# EAGLE design Electrode (EAGLE 4.09)
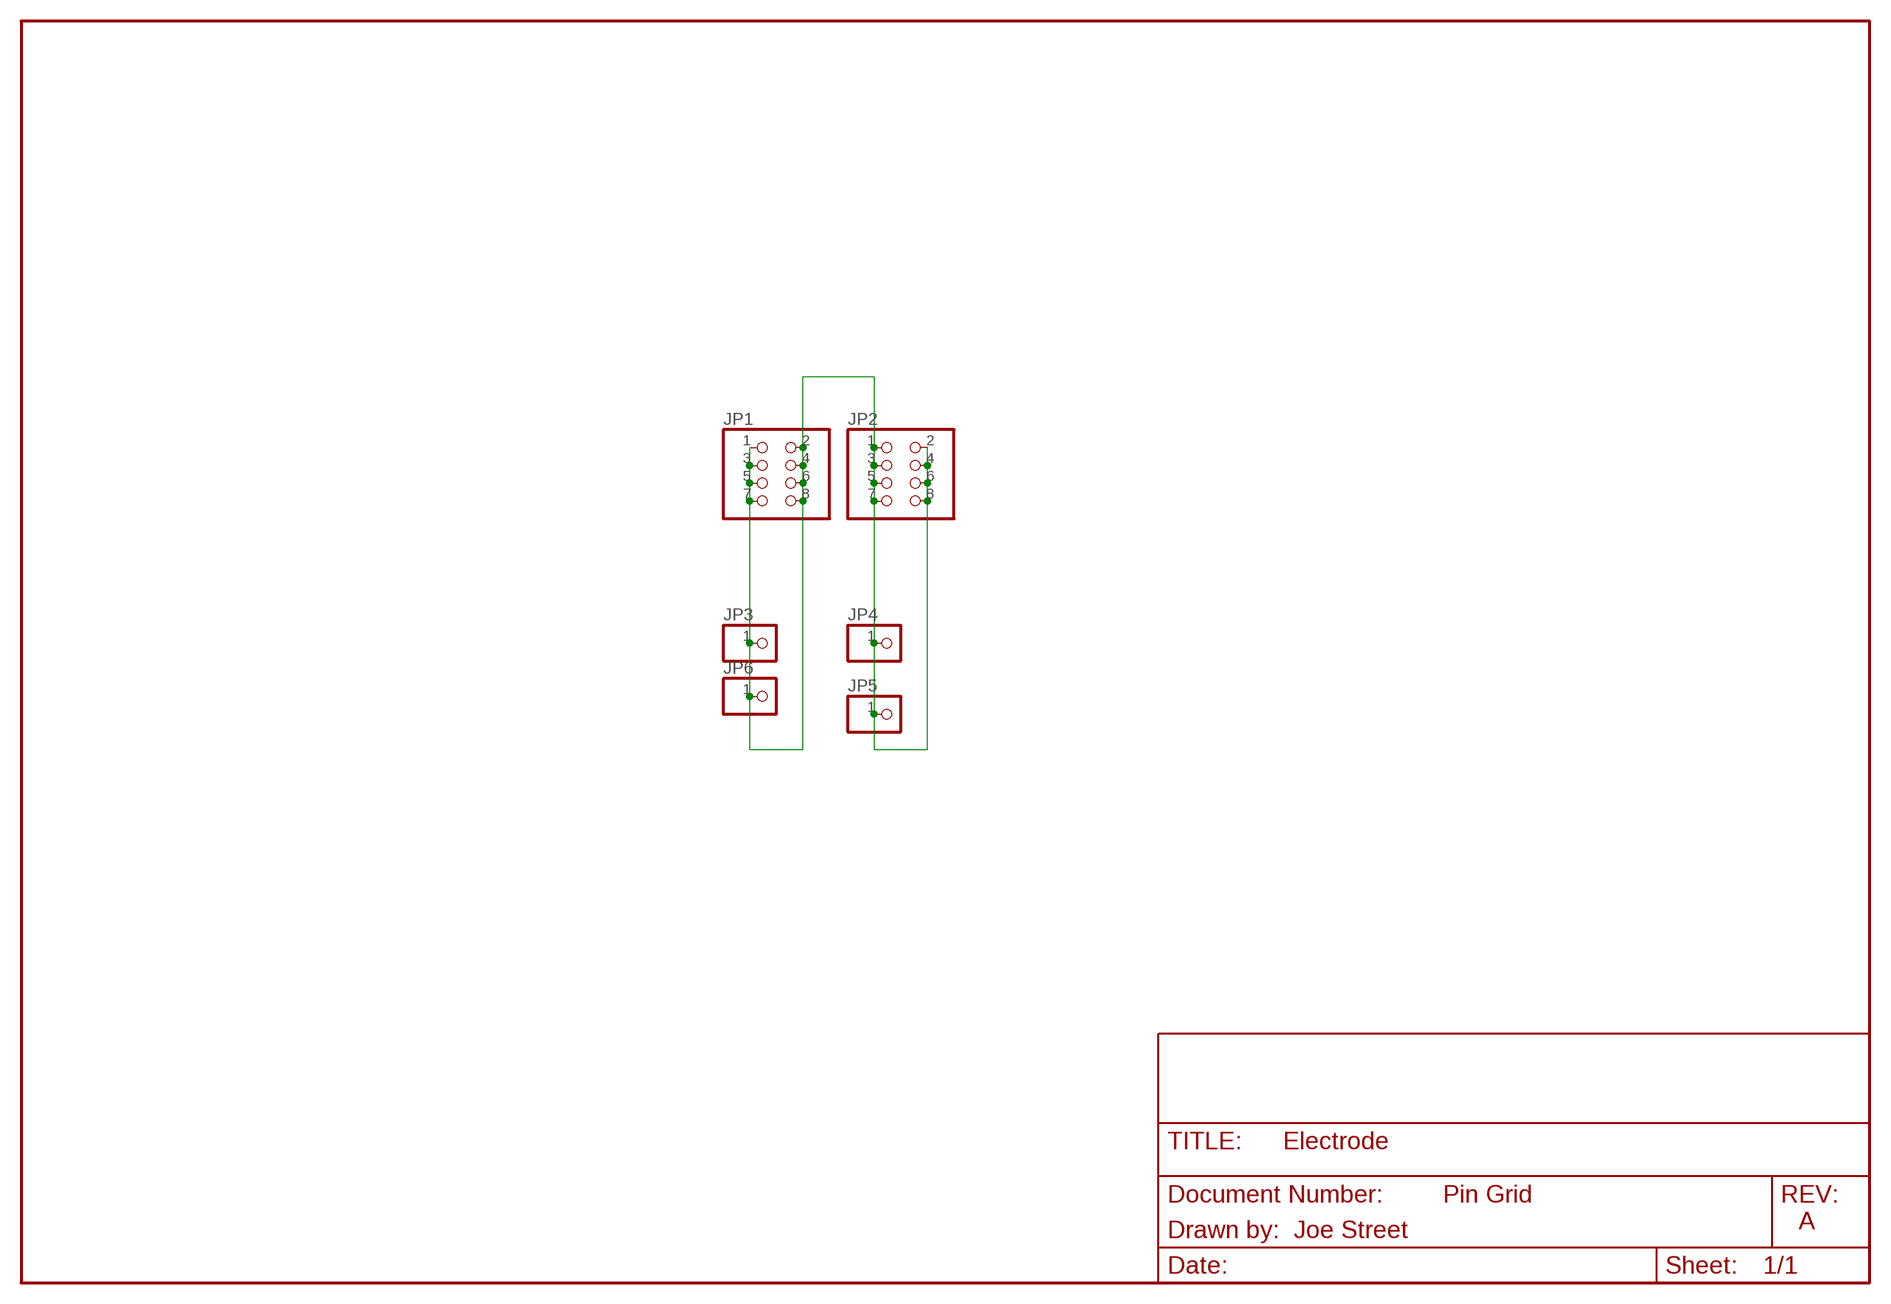
[diagram p0: schematic, sheet 1]

## Parts
JP1  PINHD-2X4  [2X04]
JP2  PINHD-2X4  [2X04]
JP3  PINHD-1X1  [1X01]
JP4  PINHD-1X1  [1X01]
JP5  PINHD-1X1  [1X01]
JP6  PINHD-1X1  [1X01]

## Nets
SIGNAL: JP1.1 JP1.2 JP1.3 JP1.4 JP1.5 JP1.6 JP1.7 JP1.8 JP2.1 JP2.2 JP2.3 JP2.4 JP2.5 JP2.6 JP2.7 JP2.8 JP3.1 JP4.1 JP5.1 JP6.1

## Notes on the sheet
- Pin Grid
- A
- Drawn by:  Joe Street

## Library data of the parts
JP1 JP2 = pc_pin:PINHD-2X4: PIN HEADER
JP3-JP6 = pinhead:PINHD-1X1: PIN HEADER

## Board
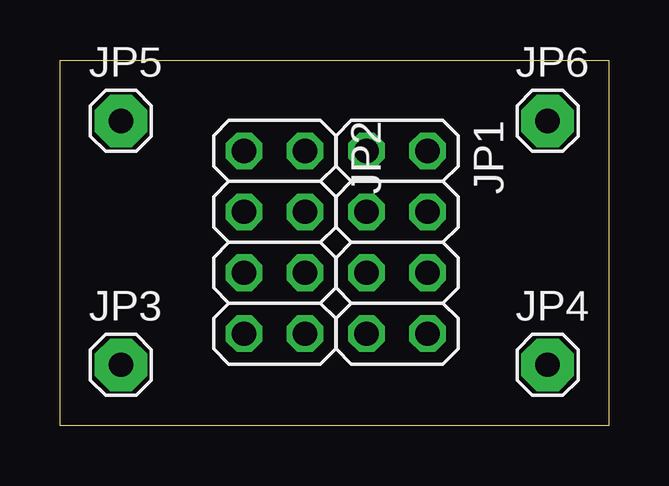
[diagram p1: board, top side]
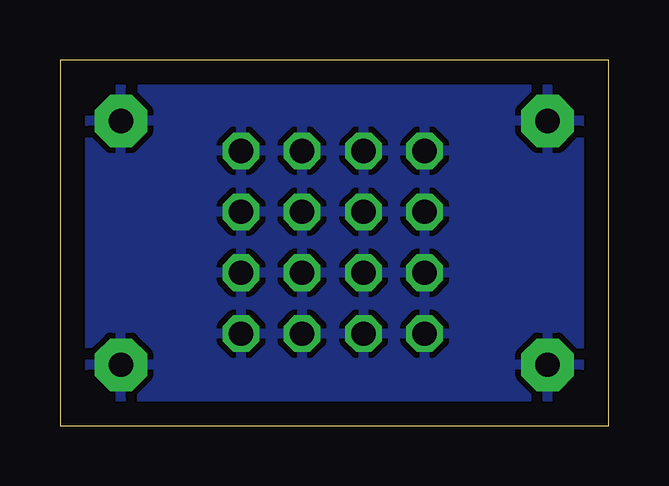
[diagram p2: board, bottom side, seen from below]

Size 22.86 x 15.24 mm. Coordinates in mm from the lower left corner, seen from the top.
Outline: 0,0 0,15.24 22.86,15.24 22.86,0 0,0
Copper layers used: Bottom

### Footprints (pad centres in the part's own frame; a part is rotated, then mirrored left to right if it is on the bottom)
2X04 = drill 1.016 octagon: 1 -3.81,-1.27; 2 -3.81,1.27; 3 -1.27,-1.27; 4 -1.27,1.27; 5 1.27,-1.27; 6 1.27,1.27; 7 3.81,-1.27; 8 3.81,1.27
1X01 = drill 1.016 pad 2.184 octagon: 1 0,0

### Placement (x,y rotation side)
JP1  14.05,7.65 270 top
JP2  8.94,7.65 270 top
JP3  2.54,2.54 0 top
JP4  20.32,2.54 0 top
JP5  2.54,12.7 0 top
JP6  20.32,12.7 0 top

### Tracks (layer width: path | path; a pad name or v marks a point on that pad's centre or on a via)
SIGNAL
  pour Bottom: 0,15.24 22.86,15.24 22.86,0 0,0